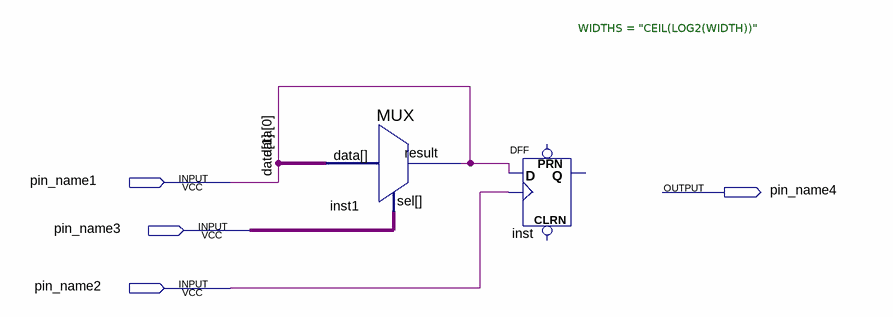
[diagram p0: schematic sheet]
// Quartus schematic one_bit_parallel_access_register.bdf as structural Verilog: 2 symbols, 4 pins
module one_bit_parallel_access_register (
  input  pin_name1,
  input  pin_name3,
  input  pin_name2,
  output pin_name4
);

  wire undriven;
  wire [0:0] data;

  MUX #(.WIDTHS("CEIL(LOG2(WIDTH))")) inst1 (.data(undriven), .sel(pin_name3), .result(data[0]));
  DFF inst (.CLK(pin_name2), .D(data[0]));  // open: CLRN, PRN, Q

  // Other names for the same wires on the sheet: data[1] = pin_name1
endmodule
